# Altium schematic sheet Control.SchDoc
size A4; SheetNumber: 1; SheetTotal: 1
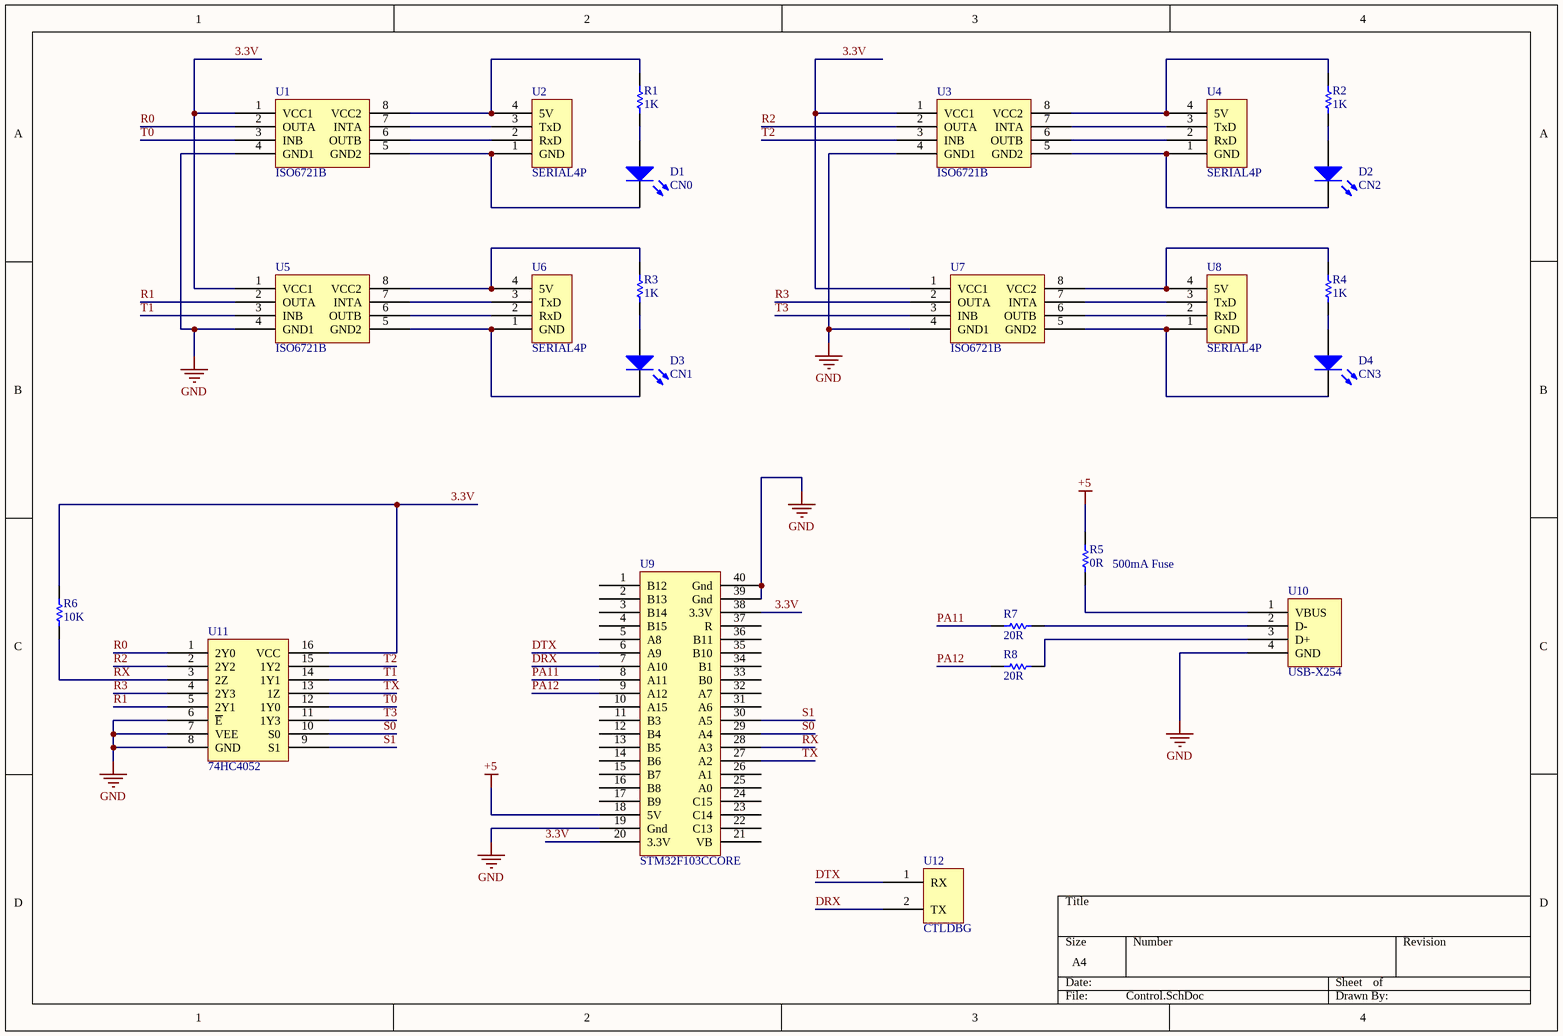
[diagram p0: Control.SchDoc]

## Parts
D1  CN0  [LED]
D2  CN2  [LED]
D3  CN1  [LED]
D4  CN3  [LED]
R1  value 1K  [RESC1608L]
R2  value 1K  [RESC1608L]
R3  value 1K  [RESC1608L]
R4  value 1K  [RESC1608L]
R5  500mA Fuse  value 0R  [RESC3216L]
R6  value 10K  [RESC1608L]
R7  value 20R  [RESC1608L]
R8  value 20R  [RESC1608L]
U1  ISO6721B  [SOP127P636-8L]
U2  SERIAL4P  [X254-4P]
U3  ISO6721B  [SOP127P636-8L]
U4  SERIAL4P  [X254-4P]
U5  ISO6721B  [SOP127P636-8L]
U6  SERIAL4P  [X254-4P]
U7  ISO6721B  [SOP127P636-8L]
U8  SERIAL4P  [X254-4P]
U9  STM32F103CCORE  [STM32F103C]
U10  USB-X254  [X254-4P]
U11  74HC4052  [SOP127P762-16L]
U12  CTLDBG  [CTLDBG]

## Nets
+5: R5.2 U9.18(5V)
GND: U1.4(GND1) U3.4(GND1) U5.4(GND1) U7.4(GND1) U9.19(Gnd) U9.39(Gnd) U9.40(Gnd) U10.4(GND) U11.6(~{E}) U11.7(VEE) U11.8(GND)
3.3V: R6.2 U1.1(VCC1) U3.1(VCC1) U5.1(VCC1) U7.1(VCC1) U9.20(3.3V) U9.38(3.3V) U11.16(VCC)
DRX: U9.7(A10) U12.2(TX)
DTX: U9.6(A9) U12.1(RX)
PA11: R7.1 U9.8(A11)
PA12: R8.1 U9.9(A12)
R0: U1.2(OUTA) U11.1(2Y0)
R1: U5.2(OUTA) U11.5(2Y1)
R2: U3.2(OUTA) U11.2(2Y2)
R3: U7.2(OUTA) U11.4(2Y3)
RX: R6.1 U9.28(A3) U11.3(2Z)
S0: U9.29(A4) U11.10(S0)
S1: U9.30(A5) U11.9(S1)
T0: U1.3(INB) U11.12(1Y0)
T1: U5.3(INB) U11.14(1Y1)
T2: U3.3(INB) U11.15(1Y2)
T3: U7.3(INB) U11.11(1Y3)
TX: U9.27(A2) U11.13(1Z)
NetD1_1: D1.1(A) R1.1
NetD1_2: D1.2(K) U1.5(GND2) U2.1(GND)
NetD2_1: D2.1(A) R2.1
NetD2_2: D2.2(K) U3.5(GND2) U4.1(GND)
NetD3_1: D3.1(A) R3.1
NetD3_2: D3.2(K) U5.5(GND2) U6.1(GND)
NetD4_1: D4.1(A) R4.1
NetD4_2: D4.2(K) U7.5(GND2) U8.1(GND)
NetR1_2: R1.2 U1.8(VCC2) U2.4(5V)
NetR2_2: R2.2 U3.8(VCC2) U4.4(5V)
NetR3_2: R3.2 U5.8(VCC2) U6.4(5V)
NetR4_2: R4.2 U7.8(VCC2) U8.4(5V)
NetR5_1: R5.1 U10.1(VBUS)
NetR7_2: R7.2 U10.2(D-)
NetR8_2: R8.2 U10.3(D+)
NetU1_6: U1.6(OUTB) U2.2(RxD)
NetU1_7: U1.7(INTA) U2.3(TxD)
NetU3_6: U3.6(OUTB) U4.2(RxD)
NetU3_7: U3.7(INTA) U4.3(TxD)
NetU5_6: U5.6(OUTB) U6.2(RxD)
NetU5_7: U5.7(INTA) U6.3(TxD)
NetU7_6: U7.6(OUTB) U8.2(RxD)
NetU7_7: U7.7(INTA) U8.3(TxD)

Not connected (* = marked no-connect by the designer): U9 1(B12) 2(B13) 3(B14) 4(B15) 5(A8) 10(A15) 11(B3) 12(B4) 13(B5) 14(B6) 15(B7) 16(B8) 17(B9) 21(VB) 22(C13) 23(C14) 24(C15) 25(A0) 26(A1) 31(A6) 32(A7) 33(B0) 34(B1) 35(B10) 36(B11) 37(R)

## Library data of the parts
D1-D4 = LED1: Typical RED GaAs LED; Published: 8-Jun-2000; LatestRevisionDate: 08-Jul-2005; LatestRevisionNote: Mech Layer 1 removed.; PackageReference: LED-1; Publisher: Altium Limited; PackageDescription: LED; 2 Leads
R1-R8 = Res1: Resistor; Published: 8-Jun-2000; LatestRevisionDate: 17-Jul-2002; LatestRevisionNote: Re-released for DXP Platform.; PackageReference: AXIAL-0.3; Publisher: Altium Limited; PackageDescription: Axial Device, Thru-Hole; 2 Leads; 0.3 in Pin Spacing